# EAGLE schematic MCU_V1 (EAGLE 7.6.0)
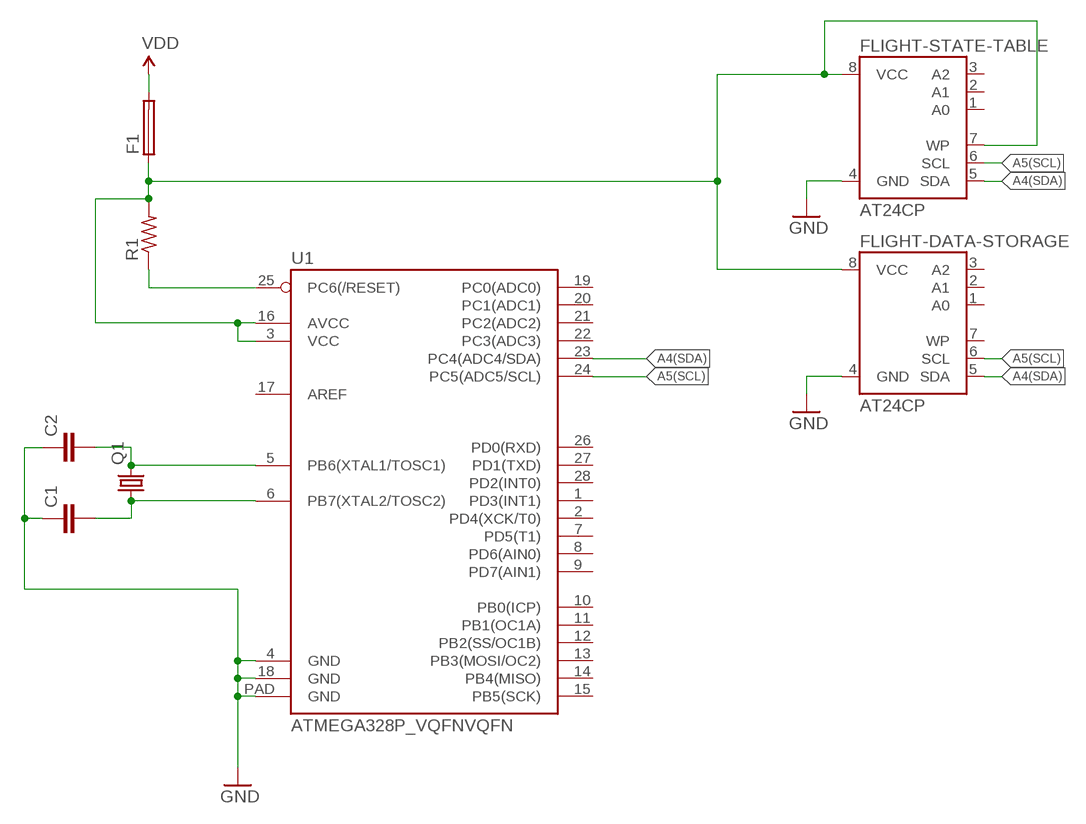
[diagram p0: schematic, sheet 1]

## Parts
C1  C2,5-3  [C2.5-3]
C2  C2,5-3  [C2.5-3]
F1  19559  [19559]
FLIGHT-DATA-STORAGE  AT24CP  [DIL08]
FLIGHT-STATE-TABLE  AT24CP  [DIL08]
Q1  CRYSTALHC33U-V  [HC33U-V]
R1  R-US_R0805  [R0805]
U1  ATMEGA328P_VQFNVQFN  [VQFN-28]

## Nets
A4(SDA): FLIGHT-DATA-STORAGE.5(SDA) FLIGHT-STATE-TABLE.5(SDA) U1.23(PC4(ADC4/SDA))
A5(SCL): FLIGHT-DATA-STORAGE.6(SCL) FLIGHT-STATE-TABLE.6(SCL) U1.24(PC5(ADC5/SCL))
GND: C1.1 C2.1 FLIGHT-DATA-STORAGE.4(GND) FLIGHT-STATE-TABLE.4(GND) U1.4(GND) U1.18(GND) U1.PAD(GND)
N$1: R1.1 U1.25(PC6(/RESET))
N$2: C2.2 Q1.2 U1.5(PB6(XTAL1/TOSC1))
N$3: C1.2 Q1.1 U1.6(PB7(XTAL2/TOSC2))
N$9: F1.1 FLIGHT-DATA-STORAGE.8(VCC) FLIGHT-STATE-TABLE.7(WP) FLIGHT-STATE-TABLE.8(VCC) R1.2 U1.3(VCC) U1.16(AVCC)
VDD: F1.2
Unconnected: FLIGHT-DATA-STORAGE.1(A0) FLIGHT-DATA-STORAGE.2(A1) FLIGHT-DATA-STORAGE.3(A2) FLIGHT-DATA-STORAGE.7(WP) FLIGHT-STATE-TABLE.1(A0) FLIGHT-STATE-TABLE.2(A1) FLIGHT-STATE-TABLE.3(A2) U1.1(PD3(INT1)) U1.2(PD4(XCK/T0)) U1.7(PD5(T1)) U1.8(PD6(AIN0)) U1.9(PD7(AIN1)) U1.10(PB0(ICP)) U1.11(PB1(OC1A)) U1.12(PB2(SS/OC1B)) U1.13(PB3(MOSI/OC2)) U1.14(PB4(MISO)) U1.15(PB5(SCK)) U1.17(AREF) U1.19(PC0(ADC0)) U1.20(PC1(ADC1)) U1.21(PC2(ADC2)) U1.22(PC3(ADC3)) U1.26(PD0(RXD)) U1.27(PD1(TXD)) U1.28(PD2(INT0))

## Library data of the parts
C1 C2 = capacitor-wima:C: CAPACITOR naming: grid - package width
F1 = fuse:19559: FUSE HOLDER TR5, Wickmann; MPN: 55900000001; OC_FARNELL: 9516360; OC_NEWARK: 02P0286
FLIGHT-DATA-STORAGE FLIGHT-STATE-TABLE = atmel:AT24C*: 2-wire serial EEPROM; MPN: AT24C1024BW-SH-B; OC_FARNELL: 1362646; OC_NEWARK: 03P2044
Q1 = adafruit:CRYSTAL: CRYSTAL; OC_FARNELL: unknown; OC_NEWARK: unknown
R1 = resistor:R-US_: RESISTOR, American symbol
U1 = SparkFun-DigitalIC:ATMEGA328P_VQFN